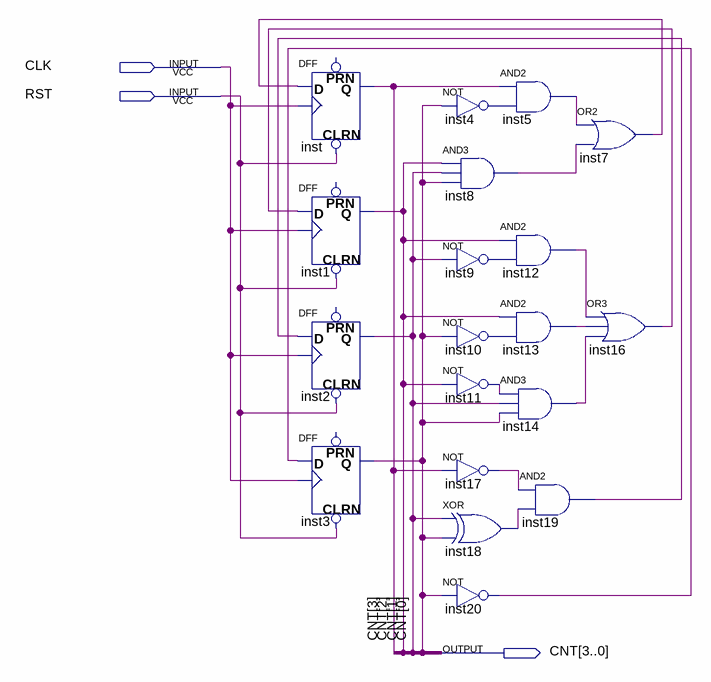
[diagram p0: schematic sheet]
// Quartus schematic DecimalCounter.bdf as structural Verilog: 19 symbols, 3 pins
module DecimalCounter (
  input  CLK,
  input  RST,
  output [3:0] CNT
);

  wire inst4_out, inst5_out, inst7_out, inst8_out, inst9_out, inst10_out, inst11_out, inst12_out, inst13_out,
       inst14_out, inst16_out, inst17_out, inst18_out, inst19_out, inst20_out;

  DFF inst (.CLRN(RST), .CLK(CLK), .D(inst7_out), .Q(CNT[3]));  // open: PRN
  DFF inst1 (.CLRN(RST), .CLK(CLK), .D(inst16_out), .Q(CNT[2]));  // open: PRN
  DFF inst2 (.CLRN(RST), .CLK(CLK), .D(inst19_out), .Q(CNT[1]));  // open: PRN
  DFF inst3 (.CLRN(RST), .CLK(CLK), .D(inst20_out), .Q(CNT[0]));  // open: PRN
  not inst4 (inst4_out, CNT[0]);
  and inst8 (inst8_out, CNT[2], CNT[1], CNT[0]);
  not inst9 (inst9_out, CNT[1]);
  not inst10 (inst10_out, CNT[0]);
  not inst11 (inst11_out, CNT[2]);
  not inst17 (inst17_out, CNT[3]);
  xor inst18 (inst18_out, CNT[1], CNT[0]);
  not inst20 (inst20_out, CNT[0]);
  and inst5 (inst5_out, CNT[3], inst4_out);
  and inst12 (inst12_out, CNT[2], inst9_out);
  and inst13 (inst13_out, CNT[2], inst10_out);
  and inst14 (inst14_out, inst11_out, CNT[1], CNT[0]);
  and inst19 (inst19_out, inst17_out, inst18_out);
  or inst7 (inst7_out, inst5_out, inst8_out);
  or inst16 (inst16_out, inst12_out, inst13_out, inst14_out);
endmodule
